# EAGLE design avrstick-uSD-shield (EAGLE 7.1.0)
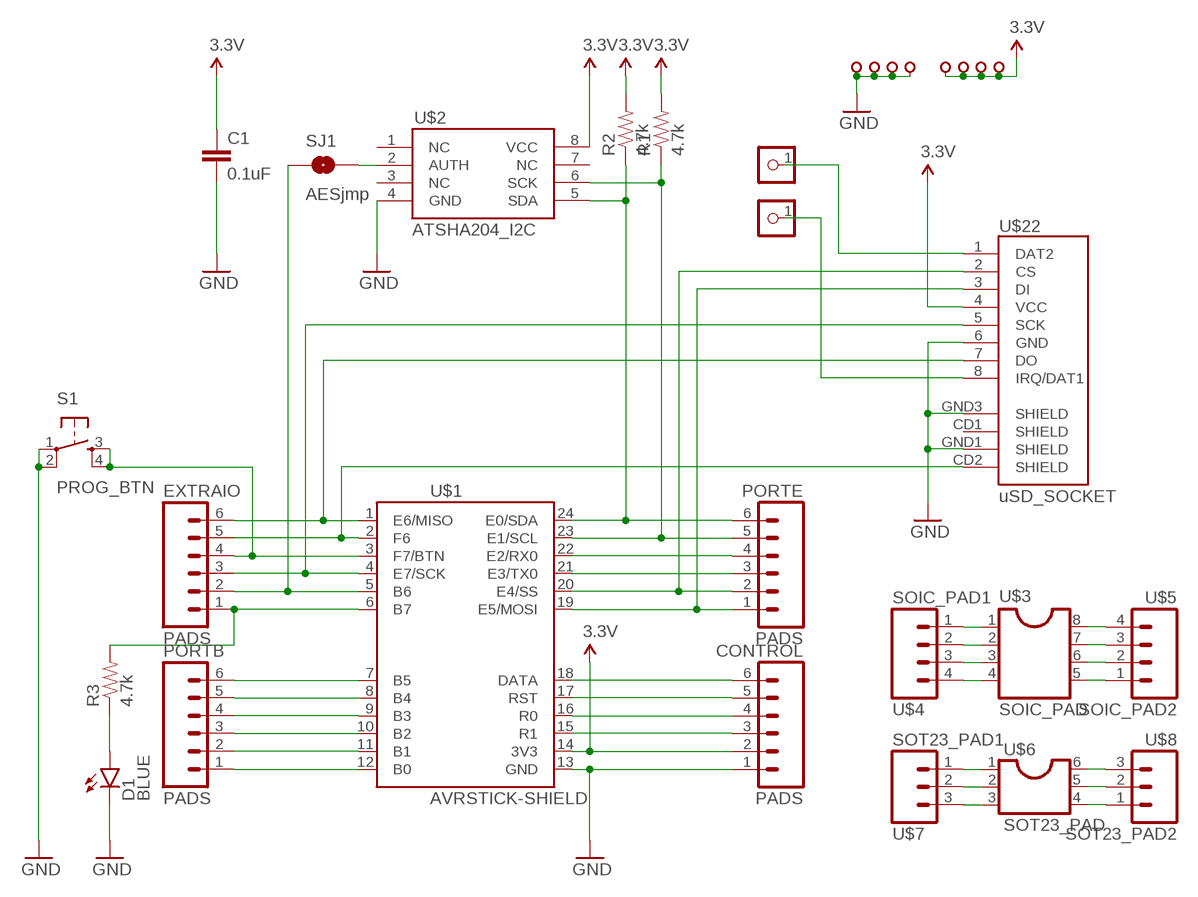
[diagram p0: schematic, sheet 1]

## Parts
C1  0.1uF  CAP1206  [1206]
CONTROL  PADS  M06_SIDESILK_BOT  [M06_SIDESILK_B]
D1  BLUE  LED-BLUE1206  [LED-1206]
EXTRAIO  PADS  M06_SIDESILK_TOP  [M06_SIDESILK_T]
J1  CON_HEADER_1X01-SMD  [SMDPAD05X05]
J2  CON_HEADER_1X01-SMD  [SMDPAD05X05]
PORTB  PADS  M06_SIDESILK_TOP  [M06_SIDESILK_T]
PORTE  PADS  M06_SIDESILK_BOT  [M06_SIDESILK_B]
R1  4.7k  RESISTOR1206  [1206]
R2  4.7k  RESISTOR1206  [1206]
R3  4.7k  RESISTOR1206  [1206]
S1  PROG_BTN  TAC_SWITCHSMD  [TACTILE-SWITCH-SMD]
SJ1  AESjmp  JUMPER-PAD-2-NOYES_SILK  [PAD-JUMPER-2-NO_YES_SILK]
U$1  AVRSTICK-SHIELD  [AVRSTICK-SHIELD]
U$2  ATSHA204_I2C  ATAES132_I2C  [SOIC-8-NARROW]
U$3  SOIC_PAD  IC-8PINSOIC-8  [SOIC-8-NARROW]
U$4  SOIC_PAD1  M04_SILK_1SQ  [M04_SILK_1SQ]
U$5  SOIC_PAD2  M04_SILK  [M04_SILK]
U$6  SOT23_PAD  IC-6PINSOT23-6  [SOT23-6]
U$7  SOT23_PAD1  M03_SILK_1SQ  [M03_SILK_1SQ]
U$8  SOT23_PAD2  M03_SILK  [M03_SILK]
U$9  M01_SIDESILK  [M01_SIDESILK]
U$10  M01_SIDESILK  [M01_SIDESILK]
U$11  M01_SIDESILK  [M01_SIDESILK]
U$12  M01_SIDESILK  [M01_SIDESILK]
U$13  M01_SIDESILK  [M01_SIDESILK]
U$14  M01_SIDESILK  [M01_SIDESILK]
U$15  M01_NOSILK  [M01_NOSILK]
U$16  M01_NOSILK  [M01_NOSILK]
U$22  uSD_SOCKET  MICROSD_SOCKET_SPARKFUN  [MICROSD_SOCKET_SPARKFUN]

## Nets
3.3V: C1.1 CONTROL.2 R1.2 R2.2 U$1.14(3V3) U$2.8(VCC) U$12.1 U$13.1 U$14.1 U$16.1 U$22.4(VCC)
GND: C1.2 CONTROL.1 D1.C S1.1 S1.2 U$1.13(GND) U$2.4(GND) U$9.1 U$10.1 U$11.1 U$15.1 U$22.6(GND) U$22.GND1(SHIELD) U$22.GND3(SHIELD)
N$1: EXTRAIO.1 R3.2 U$1.6(B7)
N$2: EXTRAIO.2 SJ1.1 U$1.5(B6)
N$3: EXTRAIO.3 U$1.4(E7/SCK) U$22.5(SCK)
N$4: PORTB.6 U$1.7(B5)
N$5: EXTRAIO.5 U$1.2(F6) U$22.CD2(SHIELD)
N$6: EXTRAIO.6 U$1.1(E6/MISO) U$22.7(DO)
N$7: EXTRAIO.4 S1.3 S1.4 U$1.3(F7/BTN)
N$8: PORTB.5 U$1.8(B4)
N$9: PORTB.4 U$1.9(B3)
N$10: PORTB.3 U$1.10(B2)
N$11: PORTB.2 U$1.11(B1)
N$12: PORTB.1 U$1.12(B0)
N$13: SJ1.2 U$2.2(AUTH)
N$14: D1.A R3.1
N$15: CONTROL.3 U$1.15(R1)
N$16: CONTROL.4 U$1.16(R0)
N$17: CONTROL.5 U$1.17(RST)
N$18: CONTROL.6 U$1.18(DATA)
N$19: PORTE.1 U$1.19(E5/MOSI) U$22.3(DI)
N$20: PORTE.2 U$1.20(E4/SS) U$22.2(CS)
N$21: PORTE.3 U$1.21(E3/TX0)
N$22: PORTE.4 U$1.22(E2/RX0)
N$23: PORTE.5 R1.1 U$1.23(E1/SCL) U$2.6(SCK)
N$24: PORTE.6 R2.1 U$1.24(E0/SDA) U$2.5(SDA)
N$25: U$3.5 U$5.1
N$26: U$3.6 U$5.2
N$27: U$3.7 U$5.3
N$28: U$3.8 U$5.4
N$29: U$3.1 U$4.1
N$30: U$3.2 U$4.2
N$31: U$3.3 U$4.3
N$32: U$3.4 U$4.4
N$33: U$6.4 U$8.1
N$34: U$6.5 U$8.2
N$35: U$6.6 U$8.3
N$36: U$6.1 U$7.1
N$37: U$6.2 U$7.2
N$38: U$6.3 U$7.3
N$39: J2.1 U$22.8(IRQ/DAT1)
N$40: J1.1 U$22.1(DAT2)
Unconnected: U$2.1(NC) U$2.3(NC) U$2.7(NC) U$22.CD1(SHIELD)

## Library data of the parts
C1 = SparkFun-Passives:CAP: Capacitor Standard 0603 ceramic capacitor, and 0.1" leaded capacitor.
CONTROL EXTRAIO PORTB PORTE = flabbergast:M06
D1 = SparkFun-LED:LED-BLUE: Blue LEDs for production use Various blue LEDs stocked by SparkFun production 0603 - DIO-08575 Rebel - DIO-09553 1206 - DIO-09911; PROD_ID: DIO-09911
J1 J2 = dp_devices:CON_HEADER_1X01
R1-R3 = SparkFun-Passives:RESISTOR: Resistor Basic schematic elements and footprints for 0603, 1206, and PTH resistors.
S1 = SparkFun-Electromechanical:TAC_SWITCH: Momentary Switch Button commonly used for reset or general input. Spark Fun Electronics SKU : COM-00097 SMT- SWCH-08247; PROD_ID: SWCH-08247; VALUE: TAC_SWITCHSMD
SJ1 = SparkFun-Passives:JUMPER-PAD-2-NO
U$1 = flabbergast:AVRSTICK-SHIELD: AVR stick from matrixstorm: outline for shields
U$2 = flabbergast:ATAES132_I2C: ATAES132 32Kbit AES I2C EEPROM from ATMEL
U$3 = flabbergast:IC-8PIN
U$4 U$5 = flabbergast:M04
U$6 = flabbergast:IC-6PIN
U$7 U$8 = flabbergast:M03
U$9-U$16 = flabbergast:M01
U$22 = flabbergast:MICROSD_SOCKET

## Board
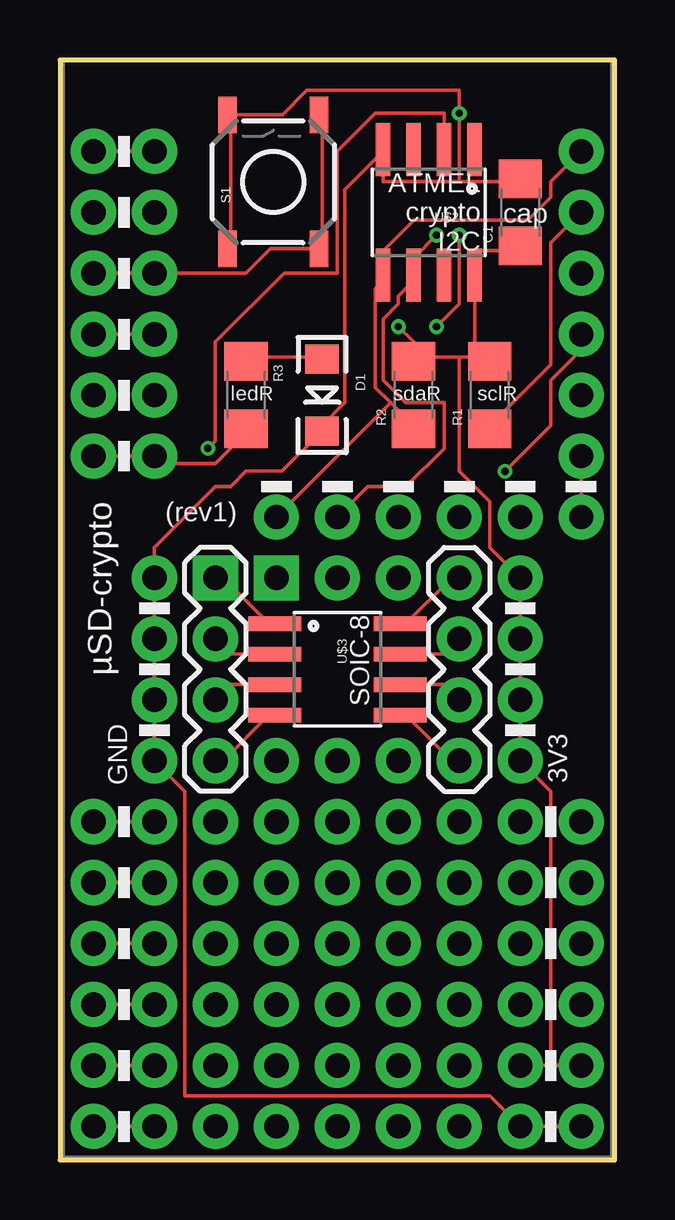
[diagram p1: board, top side]
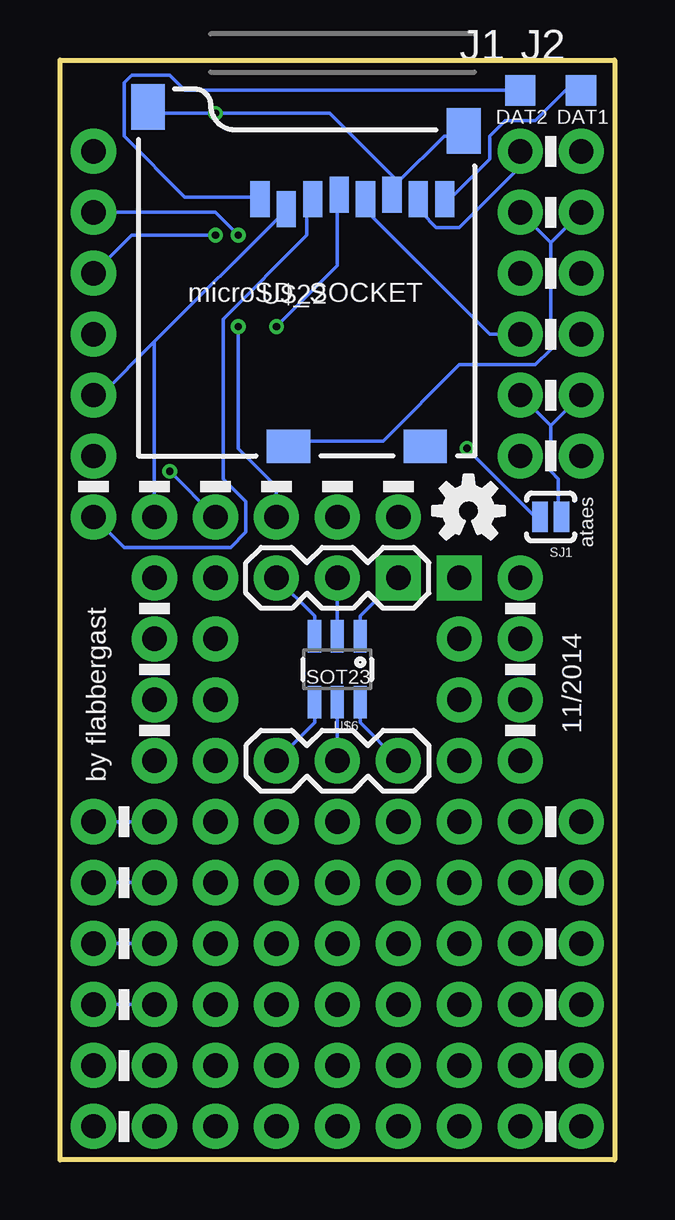
[diagram p2: board, bottom side, seen from below]

Size 23.11 x 45.85 mm. Coordinates in mm from the lower left corner, seen from the top.
Outline: 0,0 23.11,0 23.11,45.85 0,45.85 0,0
Copper layers (1*16): Top 0.035mm / dielectric 1.5mm / Bottom 0.035mm
Design rules "ITEADstudio_DRC": minimum track width 6mil, minimum drill 12mil, track to track 6mil, track to pad 6mil, pad to pad 6mil, via to via 6mil, smd to smd 0mil, copper to edge 10mil, drill to drill 10mil, minimum pad ring 10mil, minimum via ring 6mil, stop-mask expansion 2mil, vias tented up to drill 100mil, thermal gap 10mil

### Footprints (pad centres in the part's own frame; a part is rotated, then mirrored left to right if it is on the bottom)
1206 = smd 1.6 x 1.8: 1 -1.4,0; 2 1.4,0
M06_SIDESILK_B = drill 1.016 pad 1.88: 1 -5.08,0; 2 -2.54,0; 3 0,0; 4 2.54,0; 5 5.08,0; 6 7.62,0
LED-1206 = smd 1.2 x 1.4: A -1.5,0; C 1.5,0
M06_SIDESILK_T = drill 1.016 pad 1.88: 1 -5.08,0; 2 -2.54,0; 3 0,0; 4 2.54,0; 5 5.08,0; 6 7.62,0
SMDPAD05X05 = smd 1.27 x 1.27: 1 0,0
TACTILE-SWITCH-SMD = smd 1.524 x 0.762: 1 -2.794,1.905; 2 2.794,1.905; 3 -2.794,-1.905; 4 2.794,-1.905
PAD-JUMPER-2-NO_YES_SILK = smd 0.635 x 1.27: 1 -0.45,0; 2 0.45,0
AVRSTICK-SHIELD = drill 1.016 pad 1.88: 1 -12.7,22.86; 2 -12.7,20.32; 3 -12.7,17.78; 4 -12.7,15.24; 5 -12.7,12.7; 6 -12.7,10.16; 7 -12.7,-5.08; 8 -12.7,-7.62; 9 -12.7,-10.16; 10 -12.7,-12.7; 11 -12.7,-15.24; 12 -12.7,-17.78; 13 7.62,-17.78; 14 7.62,-15.24; 15 7.62,-12.7; 16 7.62,-10.16; 17 7.62,-7.62; 18 7.62,-5.08; 19 7.62,10.16; 20 7.62,12.7; 21 7.62,15.24; 22 7.62,17.78; 23 7.62,20.32; 24 7.62,22.86
SOIC-8-NARROW = smd 0.61 x 2.21: 1 -1.905,-2.616; 2 -0.635,-2.616; 3 0.635,-2.616; 4 1.905,-2.616; 5 1.905,2.616; 6 0.635,2.616; 7 -0.635,2.616; 8 -1.905,2.616
M04_SILK_1SQ = drill 1.016 pad 1.88 square: 1 -3.81,0 | drill 1.016 pad 1.88: 2 -1.27,0; 3 1.27,0; 4 3.81,0
M04_SILK = drill 1.016 pad 1.88: 1 -3.81,0; 2 -1.27,0; 3 1.27,0; 4 3.81,0
SOT23-6 = smd 0.55 x 1.35: 1 -0.95,-1.375; 2 0,-1.375; 3 0.95,-1.375; 4 0.95,1.375; 5 0,1.375; 6 -0.95,1.375
M03_SILK_1SQ = drill 1.016 pad 1.88 square: 1 -2.54,0 | drill 1.016 pad 1.88: 2 0,0; 3 2.54,0
M03_SILK = drill 1.016 pad 1.88: 1 -2.54,0; 2 0,0; 3 2.54,0
M01_SIDESILK = drill 1.016 pad 1.88: 1 0,0
M01_NOSILK = drill 1.016 pad 1.88: 1 0,0
M06_NOSILK = drill 1.016 pad 1.88: 1 -6.35,0; 2 -3.81,0; 3 -1.27,0; 4 1.27,0; 5 3.81,0; 6 6.35,0
MICROSD_SOCKET_SPARKFUN = smd 0.8 x 1.5: 1 -8.94,10.7; 2 -7.84,10.3; 3 -6.74,10.7; 4 -5.64,10.9; 5 -4.54,10.7; 6 -3.44,10.9; 7 -2.34,10.7; 8 -1.24,10.7 | smd 1.8 x 1.4: CD1 -2.05,0.4; CD2 -7.75,0.4 | smd 1.4 x 1.9: GND1 -13.6,14.55; GND3 -0.45,13.55

### Placement (x,y rotation side)
C1  19.18,39.5 90 top
CONTROL  19.18,6.48 90 top
D1  10.92,31.88 270 top
EXTRAIO  3.94,34.42 90 top
J1  3.94,44.58 0 bottom
J2  1.4,44.58 0 bottom
PORTB  3.94,6.48 90 top
PORTE  16.64,26.8 180 top
R1  17.91,31.88 90 top
R2  14.73,31.88 90 top
R3  7.75,31.88 270 top
S1  8.89,40.77 90 top
SJ1  2.67,26.8 180 bottom
U$1  14.1,19.18 0 top
U$2  15.37,39.5 180 top
U$3  11.56,20.45 270 top
U$4  6.48,20.45 270 top
U$5  16.64,20.45 90 top
U$6  11.56,20.45 180 bottom
U$7  11.56,24.26 180 bottom
U$8  11.56,16.64 0 bottom
U$9  3.94,24.26 0 top
U$10  3.94,21.72 0 top
U$11  3.94,19.18 0 top
U$12  19.18,19.18 0 top
U$13  19.18,21.72 0 top
U$14  19.18,24.26 0 top
U$15  3.94,16.64 0 top
U$16  19.18,16.64 0 top
U$17  M06_PROTOPAD  [M06_NOSILK]  6.48,7.75 90 top
U$18  M06_PROTOPAD  [M06_NOSILK]  9.02,7.75 90 top
U$19  M06_PROTOPAD  [M06_NOSILK]  11.56,7.75 90 top
U$20  M06_PROTOPAD  [M06_NOSILK]  14.1,7.75 90 top
U$21  M06_PROTOPAD  [M06_NOSILK]  16.64,7.75 90 top
U$22  5.84,29.34 0 bottom
U$23  [OSHW-LOGO-S]  6.1,27.05 0 bottom

### Tracks (layer width: path | path; a pad name or v marks a point on that pad's centre or on a via)
3.3V  (via drill 0.3)
  Top 0.152: C1.1 19.18,37.91 17.27,37.91 U$2.8 17.27,33.46 | v14.1,34.73 14.73,34.1 14.73,33.46 | 14.73,33.46 16.64,33.46 | 16.64,33.46 17.27,33.46 | 17.27,33.46 17.91,33.46 R1.2 17.27,33.46 | 14.73,33.46 R2.2 | U$1.14 20.45,3.94 | 20.45,3.94 CONTROL.2 | 20.45,3.94 20.45,15.37 U$16.1 U$12.1 U$13.1 U$14.1 17.91,25.53 17.91,27.43 16.64,28.7 16.64,33.46
  Bottom 0.152: v14.1,34.73 11.56,37.28 11.56,40.13 U$22.4
GND  (via drill 0.3)
  Top 0.152: S1.1 7.11,38.23 7.11,43.31 S1.2 | 16.64,40.77 13.46,40.77 13.46,42.04 | 16.64,40.77 19.18,40.77 C1.2 | 16.64,40.77 v16.64,43.62 16.64,44.58 10.29,44.58 9.27,43.56 S1.2 | 7.11,43.62 S1.2 | U$1.13 CONTROL.1 17.91,2.67 5.21,2.67 5.21,15.37 U$15.1 U$11.1 U$10.1 U$9.1 3.94,25.53 6.48,28.07 7.11,28.07 7.75,28.7 9.25,28.7 D1.C 10.92,30.61 11.88,31.56 11.88,40.45 13.46,42.04 | 13.46,42.04 U$2.4
  Bottom 0.152: 9.02,40.77 9.02,40.45 U$22.6 9.02,40.77 | 9.02,40.77 7.11,42.67 6.48,42.67 U$22.GND3 | 9.02,40.77 11.88,43.62 v16.64,43.62 19.18,43.62 U$22.GND1
N$1
  Top 0.152: R3.2 7.75,30.29 6.48,29.02 3.94,29.02 EXTRAIO.1 U$1.6
N$2
  Bottom 0.152: 2.67,30.61 2.67,28.7 2.35,28.38 2.35,26.8 SJ1.1 | EXTRAIO.2 2.67,30.61 | 2.67,30.61 U$1.5
N$3
  Top 0.152: EXTRAIO.3 U$1.4
  Bottom 0.152: EXTRAIO.3 5.21,34.42 10.29,39.5 10.29,39.82 U$22.5
N$4
  Top 0.152: PORTB.6 U$1.7
N$5
  Bottom 0.152: 2.67,38.23 2.67,33.78 3.3,33.15 6.48,33.15 9.65,29.97 13.46,29.97 U$22.CD2 | U$1.2 2.67,38.23 | 2.67,38.23 EXTRAIO.5
N$6
  Top 0.152: EXTRAIO.6 U$1.1
  Bottom 0.152: EXTRAIO.6 3.94,41.4 6.48,38.86 7.43,38.86 8.06,39.5 8.06,39.82 U$22.7
N$7
  Top 0.152: S1.3 10.92,38.23 10.92,43.31 S1.4 | 10.6,37.91 S1.3 | U$1.3 EXTRAIO.4 7.75,36.96 8.76,37.97 S1.3
N$8
  Top 0.152: PORTB.5 U$1.8
N$9
  Top 0.152: PORTB.4 U$1.9
N$10
  Top 0.152: PORTB.3 U$1.10
N$11
  Top 0.152: PORTB.2 U$1.11
N$12
  Top 0.152: PORTB.1 U$1.12
N$13  (via drill 0.3)
  Top 0.152: v6.16,29.65 6.48,29.97 6.48,34.1 9.33,36.96 11.56,36.96 11.56,42.04 13.15,43.62 16,43.62 U$2.2
  Bottom 0.152: v6.16,29.65 3.3,26.8 SJ1.2
N$14
  Top 0.152: D1.A 10.92,33.46 7.75,33.46 R3.1
N$15
  Bottom 0.152: U$1.15 CONTROL.3
N$16
  Bottom 0.152: U$1.16 CONTROL.4
N$17
  Bottom 0.152: U$1.17 CONTROL.5
N$18
  Bottom 0.152: U$1.18 CONTROL.6
N$19
  Top 0.152: PORTE.1 U$1.19
  Bottom 0.152: PORTE.1 20.45,25.53 16,25.53 15.37,26.16 15.37,27.43 16.32,28.38 16.32,35.05 12.83,38.54 12.83,39.82 U$22.3
N$20
  Bottom 0.152: 19.18,34.1 21.4,31.88 U$1.20 | 19.18,34.1 13.78,39.5 U$22.2 | 19.18,34.1 PORTE.2
N$21  (via drill 0.3)
  Top 0.152: v18.54,28.7 20.45,30.61 20.45,32.51 21.72,33.78 U$1.21
  Bottom 0.152: v18.54,28.7 PORTE.3
N$22  (via drill 0.3)
  Top 0.152: v15.68,34.73 16.64,35.69 v16.64,38.54
  Bottom 0.152: PORTE.4 14.1,28.07 15.68,29.65 v15.68,34.73 | v16.64,38.54 20.13,38.54 U$1.22
N$23  (via drill 0.3)
  Top 0.152: U$1.23 20.45,38.23 20.45,33.15 17.91,30.61 R1.1 | v15.68,38.54 14.73,37.59 U$2.6 14.73,36.64 14.1,36 14.1,35.69 13.46,35.05 13.46,32.51 14.41,31.56 16,31.56 16,29.65 14.41,28.07 12.83,28.07 PORTE.5
  Bottom 0.152: U$1.23 16.64,39.5 v15.68,38.54
N$24
  Top 0.152: 13.78,31.56 13.15,32.2 13.15,36.32 13.46,36.64 U$2.5 13.46,37.91 14.73,39.18 19.49,39.18 20.45,40.13 20.45,40.77 U$1.24 | 13.78,31.56 14.73,30.61 R2.1 | 13.78,31.56 PORTE.6
N$25
  Top 0.152: U$5.1 16.32,16.64 14.41,18.54 U$3.5
N$26
  Top 0.152: U$3.6 16.64,19.81 U$5.2
N$27
  Top 0.152: U$3.7 16.64,21.08 U$5.3
N$28
  Top 0.152: U$5.4 16.32,24.26 14.41,22.35 U$3.8
N$29
  Top 0.152: U$4.1 6.79,24.26 8.7,22.35 U$3.1
N$30
  Top 0.152: U$3.2 6.48,21.08 U$4.2
N$31
  Top 0.152: U$3.3 6.48,19.81 U$4.3
N$32
  Top 0.152: U$4.4 6.79,16.64 8.7,18.54 U$3.4
N$33
  Bottom 0.152: U$8.1 12.51,18.22 12.51,18.86 U$6.4
N$34
  Bottom 0.152: U$8.2 U$6.5
N$35
  Bottom 0.152: U$8.3 10.6,18.22 10.6,18.86 U$6.6
N$36
  Bottom 0.152: U$7.1 10.6,22.67 10.6,22.03 U$6.1
N$37
  Bottom 0.152: U$7.2 U$6.2
N$38
  Bottom 0.152: U$7.3 12.51,22.67 12.51,22.03 U$6.3
N$39
  Bottom 0.152: J2.1 2.03,44.58 3.3,43.31 4.57,43.31 5.21,42.67 5.21,41.72 6.79,40.13 U$22.8
N$40
  Bottom 0.152: J1.1 17.91,44.58 18.54,45.21 20.13,45.21 20.45,44.89 20.45,42.67 17.91,40.13 15.05,40.13 U$22.1

### Text on the board
tPlace: ATMEL / crypto / I2C | cap | ledR | sdaR | sclR | µSD-crypto | (rev1) | SOIC-8 | 3V3 | GND
bPlace: DAT1 | DAT2 | microSD_SOCKET | ataes | SOT23 | 11/2014 | by flabbergast